# EAGLE schematic main (EAGLE 9.6.2)
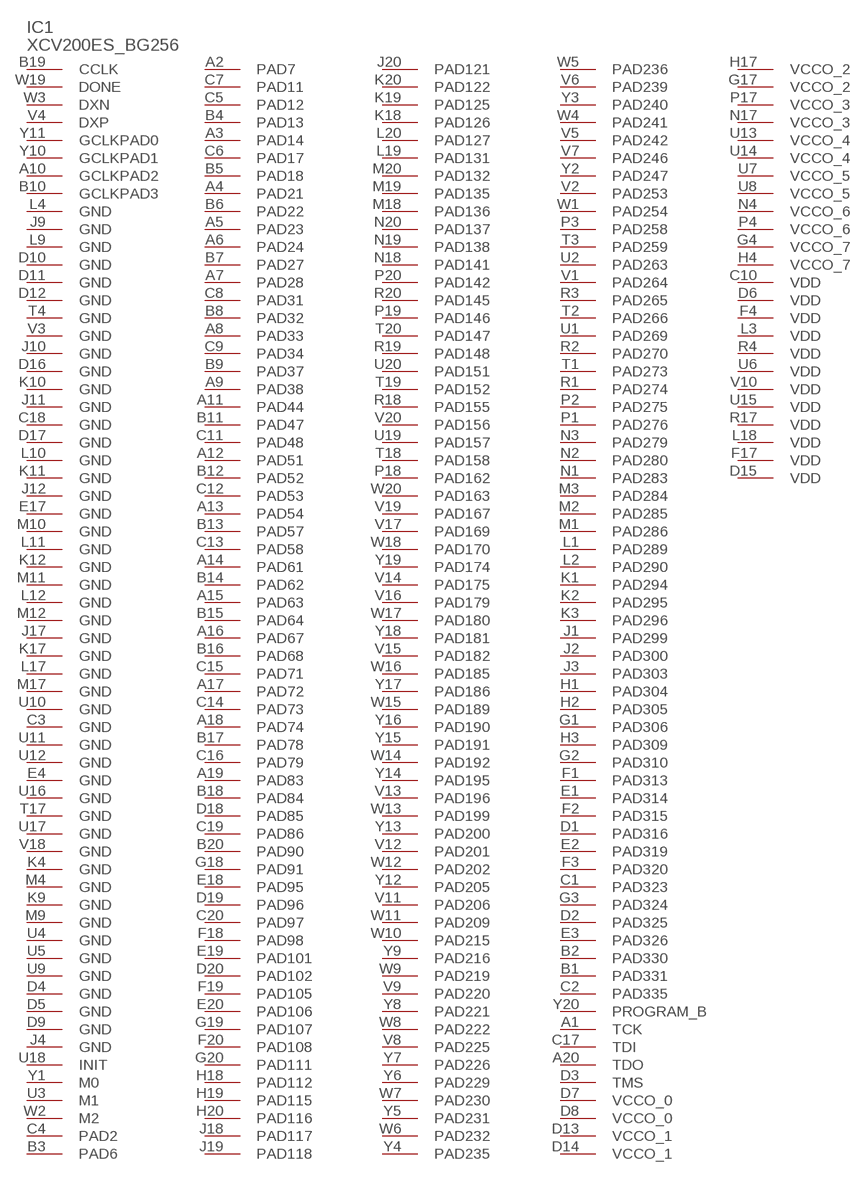
[diagram p0: schematic, sheet 1]

## Parts
IC1  XCV200ES_BG256  [BG256]
Unconnected: IC1.A1(TCK) IC1.A2(PAD7) IC1.A3(PAD14) IC1.A4(PAD21) IC1.A5(PAD23) IC1.A6(PAD24) IC1.A7(PAD28) IC1.A8(PAD33) IC1.A9(PAD38) IC1.A10(GCLKPAD2) IC1.A11(PAD44) IC1.A12(PAD51) IC1.A13(PAD54) IC1.A14(PAD61) IC1.A15(PAD63) IC1.A16(PAD67) IC1.A17(PAD72) IC1.A18(PAD74) IC1.A19(PAD83) IC1.A20(TDO) IC1.B1(PAD331) IC1.B2(PAD330) IC1.B3(PAD6) IC1.B4(PAD13) IC1.B5(PAD18) IC1.B6(PAD22) IC1.B7(PAD27) IC1.B8(PAD32) IC1.B9(PAD37) IC1.B10(GCLKPAD3) IC1.B11(PAD47) IC1.B12(PAD52) IC1.B13(PAD57) IC1.B14(PAD62) IC1.B15(PAD64) IC1.B16(PAD68) IC1.B17(PAD78) IC1.B18(PAD84) IC1.B19(CCLK) IC1.B20(PAD90) IC1.C1(PAD323) IC1.C2(PAD335) IC1.C4(PAD2) IC1.C5(PAD12) IC1.C6(PAD17) IC1.C7(PAD11) IC1.C8(PAD31) IC1.C9(PAD34) IC1.C11(PAD48) IC1.C12(PAD53) IC1.C13(PAD58) IC1.C14(PAD73) IC1.C15(PAD71) IC1.C16(PAD79) IC1.C17(TDI) IC1.C19(PAD86) IC1.C20(PAD97) IC1.D1(PAD316) IC1.D2(PAD325) IC1.D3(TMS) IC1.D18(PAD85) IC1.D19(PAD96) IC1.D20(PAD102) IC1.E1(PAD314) IC1.E2(PAD319) IC1.E3(PAD326) IC1.E18(PAD95) IC1.E19(PAD101) IC1.E20(PAD106) IC1.F1(PAD313) IC1.F2(PAD315) IC1.F3(PAD320) IC1.F18(PAD98) IC1.F19(PAD105) IC1.F20(PAD108) IC1.G1(PAD306) IC1.G2(PAD310) IC1.G3(PAD324) IC1.G18(PAD91) IC1.G19(PAD107) IC1.G20(PAD111) IC1.H1(PAD304) IC1.H2(PAD305) IC1.H3(PAD309) IC1.H18(PAD112) IC1.H19(PAD115) IC1.H20(PAD116) IC1.J1(PAD299) IC1.J2(PAD300) IC1.J3(PAD303) IC1.J18(PAD117) IC1.J19(PAD118) IC1.J20(PAD121) IC1.K1(PAD294) IC1.K2(PAD295) IC1.K3(PAD296) IC1.K18(PAD126) IC1.K19(PAD125) IC1.K20(PAD122) IC1.L1(PAD289) IC1.L2(PAD290) IC1.L19(PAD131) IC1.L20(PAD127) IC1.M1(PAD286) IC1.M2(PAD285) IC1.M3(PAD284) IC1.M18(PAD136) IC1.M19(PAD135) IC1.M20(PAD132) IC1.N1(PAD283) IC1.N2(PAD280) IC1.N3(PAD279) IC1.N18(PAD141) IC1.N19(PAD138) IC1.N20(PAD137) IC1.P1(PAD276) IC1.P2(PAD275) IC1.P3(PAD258) IC1.P18(PAD162) IC1.P19(PAD146) IC1.P20(PAD142) IC1.R1(PAD274) IC1.R2(PAD270) IC1.R3(PAD265) IC1.R18(PAD155) IC1.R19(PAD148) IC1.R20(PAD145) IC1.T1(PAD273) IC1.T2(PAD266) IC1.T3(PAD259) IC1.T18(PAD158) IC1.T19(PAD152) IC1.T20(PAD147) IC1.U1(PAD269) IC1.U2(PAD263) IC1.U3(M1) IC1.U18(INIT) IC1.U19(PAD157) IC1.U20(PAD151) IC1.V1(PAD264) IC1.V2(PAD253) IC1.V4(DXP) IC1.V5(PAD242) IC1.V6(PAD239) IC1.V7(PAD246) IC1.V8(PAD225) IC1.V9(PAD220) IC1.V11(PAD206) IC1.V12(PAD201) IC1.V13(PAD196) IC1.V14(PAD175) IC1.V15(PAD182) IC1.V16(PAD179) IC1.V17(PAD169) IC1.V19(PAD167) IC1.V20(PAD156) IC1.W1(PAD254) IC1.W2(M2) IC1.W3(DXN) IC1.W4(PAD241) IC1.W5(PAD236) IC1.W6(PAD232) IC1.W7(PAD230) IC1.W8(PAD222) IC1.W9(PAD219) IC1.W10(PAD215) IC1.W11(PAD209) IC1.W12(PAD202) IC1.W13(PAD199) IC1.W14(PAD192) IC1.W15(PAD189) IC1.W16(PAD185) IC1.W17(PAD180) IC1.W18(PAD170) IC1.W19(DONE) IC1.W20(PAD163) IC1.Y1(M0) IC1.Y2(PAD247) IC1.Y3(PAD240) IC1.Y4(PAD235) IC1.Y5(PAD231) IC1.Y6(PAD229) IC1.Y7(PAD226) IC1.Y8(PAD221) IC1.Y9(PAD216) IC1.Y10(GCLKPAD1) IC1.Y11(GCLKPAD0) IC1.Y12(PAD205) IC1.Y13(PAD200) IC1.Y14(PAD195) IC1.Y15(PAD191) IC1.Y16(PAD190) IC1.Y17(PAD186) IC1.Y18(PAD181) IC1.Y19(PAD174) IC1.Y20(PROGRAM_B)

## Power pins joined to a net without a drawn wire
GND: IC1.C3(GND) IC1.C18(GND) IC1.D4(GND) IC1.D5(GND) IC1.D9(GND) IC1.D10(GND) IC1.D11(GND) IC1.D12(GND) IC1.D16(GND) IC1.D17(GND) IC1.E4(GND) IC1.E17(GND) IC1.J4(GND) IC1.J9(GND) IC1.J10(GND) IC1.J11(GND) IC1.J12(GND) IC1.J17(GND) IC1.K4(GND) IC1.K9(GND) IC1.K10(GND) IC1.K11(GND) IC1.K12(GND) IC1.K17(GND) IC1.L4(GND) IC1.L9(GND) IC1.L10(GND) IC1.L11(GND) IC1.L12(GND) IC1.L17(GND) IC1.M4(GND) IC1.M9(GND) IC1.M10(GND) IC1.M11(GND) IC1.M12(GND) IC1.M17(GND) IC1.T4(GND) IC1.T17(GND) IC1.U4(GND) IC1.U5(GND) IC1.U9(GND) IC1.U10(GND) IC1.U11(GND) IC1.U12(GND) IC1.U16(GND) IC1.U17(GND) IC1.V3(GND) IC1.V18(GND)
VCCO_0: IC1.D7(VCCO_0) IC1.D8(VCCO_0)
VCCO_1: IC1.D13(VCCO_1) IC1.D14(VCCO_1)
VCCO_2: IC1.G17(VCCO_2) IC1.H17(VCCO_2)
VCCO_3: IC1.N17(VCCO_3) IC1.P17(VCCO_3)
VCCO_4: IC1.U13(VCCO_4) IC1.U14(VCCO_4)
VCCO_5: IC1.U7(VCCO_5) IC1.U8(VCCO_5)
VCCO_6: IC1.N4(VCCO_6) IC1.P4(VCCO_6)
VCCO_7: IC1.G4(VCCO_7) IC1.H4(VCCO_7)
VDD: IC1.C10(VDD) IC1.D6(VDD) IC1.D15(VDD) IC1.F4(VDD) IC1.F17(VDD) IC1.L3(VDD) IC1.L18(VDD) IC1.R4(VDD) IC1.R17(VDD) IC1.U6(VDD) IC1.U15(VDD) IC1.V10(VDD)

## Library data of the parts
IC1 = xilinx-xcv:XCV200ES_BG256: xcv200es_bg256 edit this description Auto generated by make-symbol-device-package-bsdl.ulp Rev. 26 Source: xcv200es_bg256.bsd; OC_FARNELL: unknown; OC_NEWARK: unknown